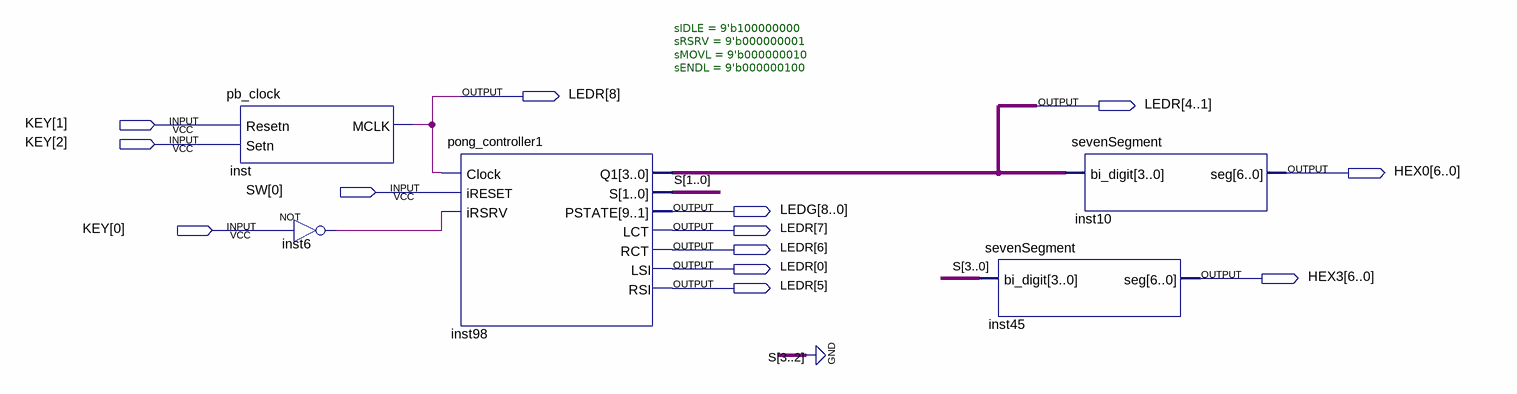
[diagram p0: schematic sheet]
// Quartus schematic Lab8b.bdf as structural Verilog: 5 symbols, 13 pins
module Lab8b (
  input  [2:0] KEY,
  input  [0:0] SW,
  output [8:0] LEDR,
  output [6:0] HEX0,
  output [8:0] LEDG,
  output [6:0] HEX3
);

  wire inst6_out;
  wire [1:0] S;

  pb_clock inst (.Resetn(KEY[1]), .Setn(KEY[2]), .MCLK(LEDR[8]));
  not inst6 (inst6_out, KEY[0]);
  pong_controller1 #(.sIDLE(9'b100000000), .sRSRV(9'b000000001), .sMOVL(9'b000000010), .sENDL(9'b000000100)) inst98 (
    .Clock(LEDR[8]), .iRESET(SW[0]), .iRSRV(inst6_out), .Q1(LEDR[4:1]), .S(S), .PSTATE(LEDG), .LCT(LEDR[7]),
    .RCT(LEDR[6]), .LSI(LEDR[0]), .RSI(LEDR[5]));
  sevenSegment inst45 (.bi_digit({2'b00, S}), .seg(HEX3));
  sevenSegment inst10 (.bi_digit(LEDR[4:1]), .seg(HEX0));
endmodule
